# EAGLE design ctrl (EAGLE 9.4.2)
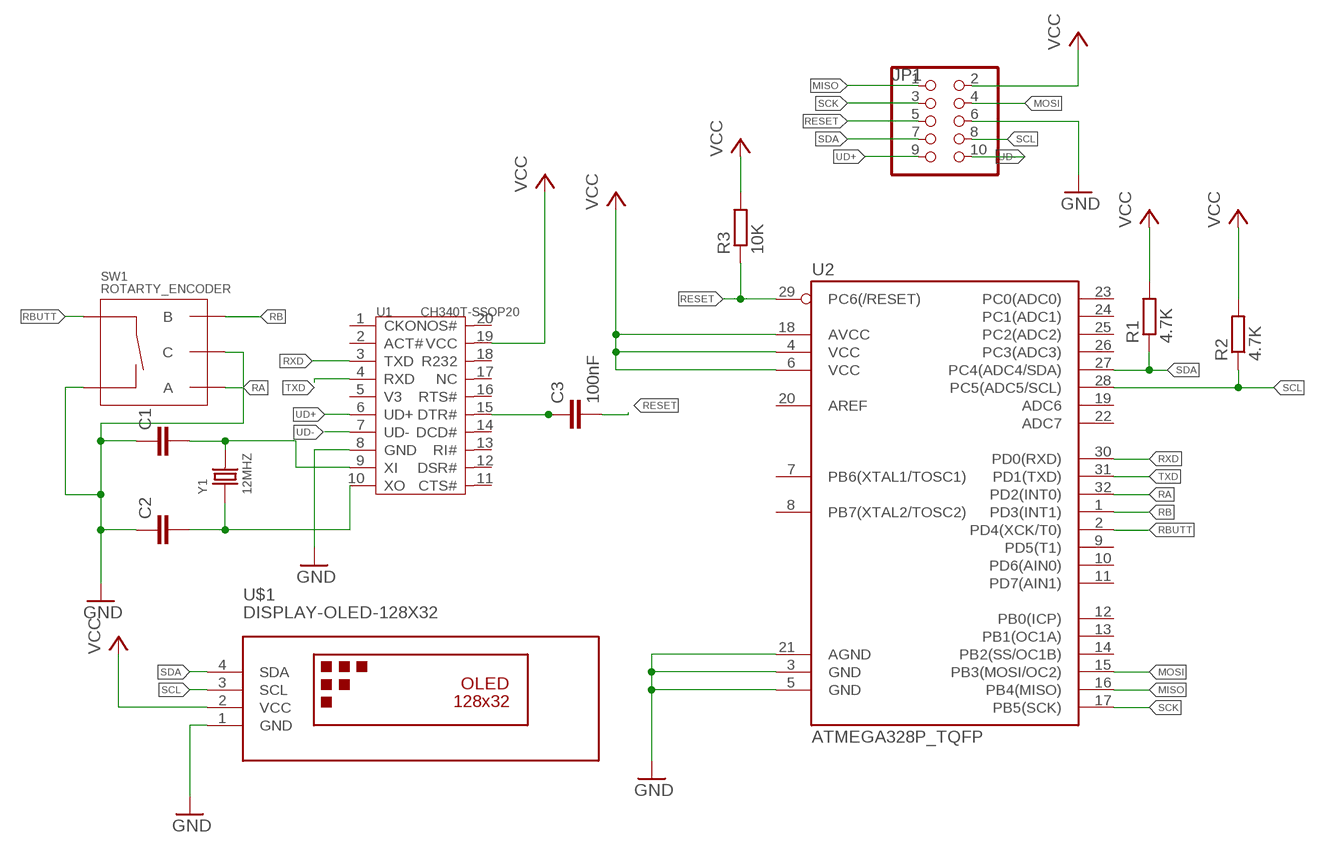
[diagram p0: schematic, sheet 1]

## Parts
C1  C-EUC0805  [C0805]
C2  C-EUC0805  [C0805]
C3  100nF  C-EUC0805  [C0805]
JP1  PINHD-2X5  [2X05]
R1  4.7K  R-EU_M0805  [M0805]
R2  4.7K  R-EU_M0805  [M0805]
R3  10K  R-EU_M0805  [M0805]
SW1  ROTARTY_ENCODER  [ROTARY_ENC_PLAIN]
U1  CH340T-SSOP20  INTERFACE-CH340T(SSOP20)  [SSOP20-0.65-7.6X5.2MM]
U2  ATMEGA328P_TQFP  [TQFP32-08]
U$1  DISPLAY-OLED-128X32  [DISPLAY-OLED-128X32]
Y1  12MHZ  SMD-CRYSTAL-12MHZ-20PF-20PPM-40R(2P-5.0X3.2MM)  [X2-SMD-5.0X3.2X1.3MM]

## Nets
GND: C1.1 C2.1 JP1.6 SW1.C SW1.SW- U1.8(GND) U2.3(GND) U2.5(GND) U2.21(AGND) U$1.1(GND)
MISO: JP1.1 U2.16(PB4(MISO))
MOSI: JP1.4 U2.15(PB3(MOSI/OC2))
N$1: C1.2 U1.9(XI) Y1.2
N$2: C3.1 U1.15(DTR#)
N$3: C2.2 U1.10(XO) Y1.1
RA: SW1.A U2.32(PD2(INT0))
RB: SW1.B U2.1(PD3(INT1))
RBUTT: SW1.SW+ U2.2(PD4(XCK/T0))
RESET: C3.2 JP1.5 R3.1 U2.29(PC6(/RESET))
RXD: U1.3(TXD) U2.30(PD0(RXD))
SCK: JP1.3 U2.17(PB5(SCK))
SCL: JP1.8 R2.1 U2.28(PC5(ADC5/SCL)) U$1.3(SCL)
SDA: JP1.7 R1.1 U2.27(PC4(ADC4/SDA)) U$1.4(SDA)
TXD: U1.4(RXD) U2.31(PD1(TXD))
UD+: JP1.9 U1.6(UD+)
UD-: JP1.10 U1.7(UD-)
VCC: JP1.2 R1.2 R2.2 R3.2 U1.19(VCC) U2.4(VCC) U2.6(VCC) U2.18(AVCC) U$1.2(VCC)
Unconnected: U1.1(CKO) U1.2(ACT#) U1.5(V3) U1.11(CTS#) U1.12(DSR#) U1.13(RI#) U1.14(DCD#) U1.16(RTS#) U1.17(NC) U1.18(R232) U1.20(NOS#) U2.7(PB6(XTAL1/TOSC1)) U2.8(PB7(XTAL2/TOSC2)) U2.9(PD5(T1)) U2.10(PD6(AIN0)) U2.11(PD7(AIN1)) U2.12(PB0(ICP)) U2.13(PB1(OC1A)) U2.14(PB2(SS/OC1B)) U2.19(ADC6) U2.20(AREF) U2.22(ADC7) U2.23(PC0(ADC0)) U2.24(PC1(ADC1)) U2.25(PC2(ADC2)) U2.26(PC3(ADC3))

## Library data of the parts
C1-C3 = resistor:C-EU: CAPACITOR, European symbol
JP1 = pinhead:PINHD-2X5: PIN HEADER
R1-R3 = resistor:R-EU_: RESISTOR, European symbol
SW1 = SparkFun-Electromechanical:ROTARTY_ENCODER: Simple no LED rotary encoder Example: COM-09117
U1 = Seeed-IC:INTERFACE-CH340T(SSOP20): 310070026; MPN: CH340T
U2 = SparkFun-DigitalIC:ATMEGA328P_TQFP; PROD_ID: IC-09069
U$1 = diy-modules:DISPLAY-OLED-128X32: 128x32 Dot Matrix OLED Module with I2C interface based on SSD1306 chip More details available here: http://www.tinyosshop.com/index.php?route=product/product&product_id=953 Schematic available here: http://www.tinyosshop.com/datasheet/OLED%2012832.pdf SSD1306 datasheet: https://cdn-shop.adafruit.com/datasheets/SSD1306.pdf Click here to find device on ebay.com <http://www.ebay.com/sch/oled+display+128x32+i2c>
Y1 = Seeed-Crystal Oscillator:SMD-CRYSTAL-12MHZ-20PF-20PPM-40R(2P-5.0X3.2MM): 306010047; MPN: 5032/2P

## Board
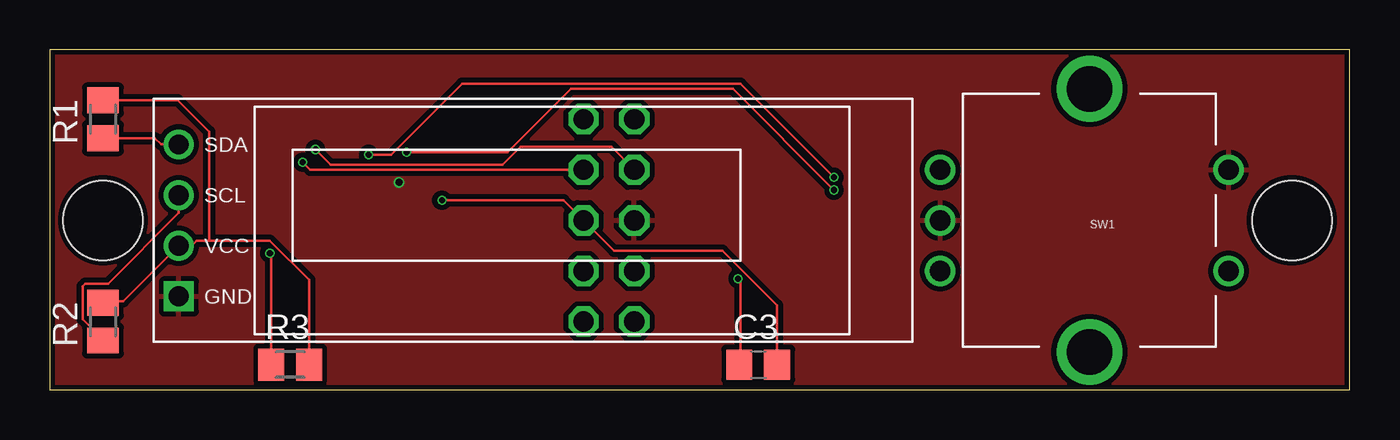
[diagram p1: board, top side]
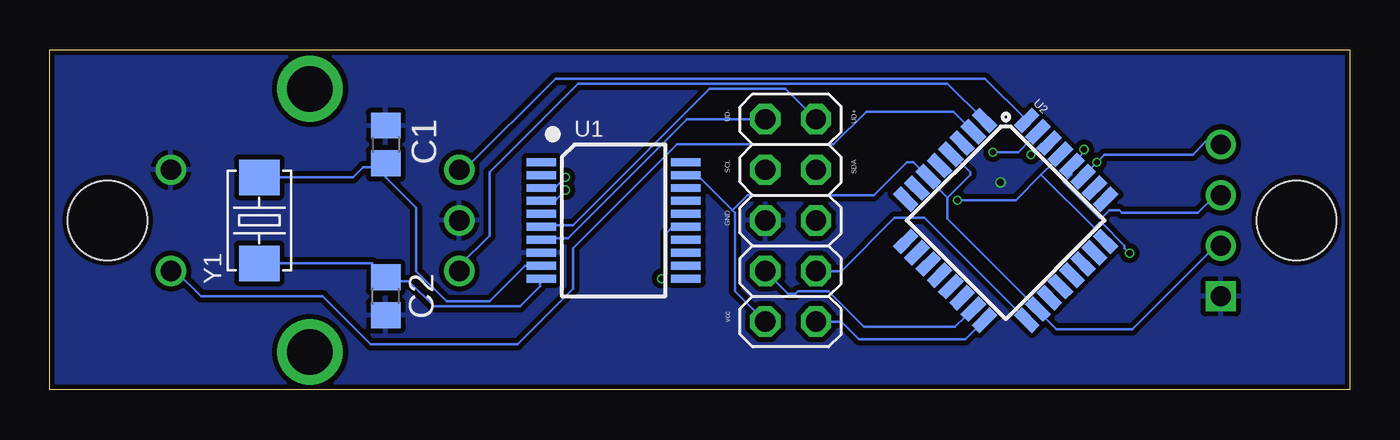
[diagram p2: board, bottom side, seen from below]

Size 65.26 x 17.07 mm. Coordinates in mm from the lower left corner, seen from the top.
Outline: 0,0 65.26,0 65.26,17.07 0,17.07 0,0
Copper layers (1*16): Top 0.035559375mm / dielectric 1.6mm / Bottom 0.035559375mm
Design rules "jlcpcb2layer": minimum track width 5mil, minimum drill 12mil, track to track 5mil, track to pad 5mil, pad to pad 5mil, via to via 5mil, smd to smd 5mil, copper to edge 8mil, drill to drill 6mil, minimum pad ring 5mil, minimum via ring 3mil, stop-mask expansion 2.5mil, vias tented up to drill 0mil, thermal gap 10mil
Holes 4 mm at 2.67,8.51 62.36,8.51

### Footprints (pad centres in the part's own frame; a part is rotated, then mirrored left to right if it is on the bottom)
C0805 = smd 1.3 x 1.5: 1 -0.95,0; 2 0.95,0
2X05 = drill 1.016 octagon: 1 -5.08,-1.27; 2 -5.08,1.27; 3 -2.54,-1.27; 4 -2.54,1.27; 5 0,-1.27; 6 0,1.27; 7 2.54,-1.27; 8 2.54,1.27; 9 5.08,-1.27; 10 5.08,1.27
M0805 = smd 1.3 x 1.6: 1 -0.95,0; 2 0.95,0
ROTARY_ENC_PLAIN = drill 1.016: A 7.493,-2.54; B 7.493,2.54; C 7.493,0; SW+ -6.985,2.54; SW- -6.985,-2.54 | drill 2.286: P$3 0,6.604; P$4 0,-6.604
SSOP20-0.65-7.6X5.2MM = smd 0.4 x 1.5: 1 -2.925,-3.625; 2 -2.275,-3.625; 3 -1.625,-3.625; 4 -0.975,-3.625; 5 -0.325,-3.625; 6 0.325,-3.625; 7 0.975,-3.625; 8 1.625,-3.625; 9 2.275,-3.625; 10 2.925,-3.625; 11 2.925,3.625; 12 2.275,3.625; 13 1.625,3.625; 14 0.975,3.625; 15 0.325,3.625; 16 -0.325,3.625; 17 -0.975,3.625; 18 -1.625,3.625; 19 -2.275,3.625; 20 -2.925,3.625
TQFP32-08 = smd 1.27 x 0.559: 1 -4.293,2.8; 2 -4.293,2; 3 -4.293,1.2; 4 -4.293,0.4; 5 -4.293,-0.4; 6 -4.293,-1.2; 7 -4.293,-2; 8 -4.293,-2.8; 17 4.293,-2.8; 18 4.293,-2; 19 4.293,-1.2; 20 4.293,-0.4; 21 4.293,0.4; 22 4.293,1.2; 23 4.293,2; 24 4.293,2.8 | smd 0.559 x 1.27: 9 -2.8,-4.293; 10 -2,-4.293; 11 -1.2,-4.293; 12 -0.4,-4.293; 13 0.4,-4.293; 14 1.2,-4.293; 15 2,-4.293; 16 2.8,-4.293; 25 2.8,4.293; 26 2,4.293; 27 1.2,4.293; 28 0.4,4.293; 29 -0.4,4.293; 30 -1.2,4.293; 31 -2,4.293; 32 -2.8,4.293
DISPLAY-OLED-128X32 = drill 1 square: 1 -17.78,-3.81 | drill 1: 2 -17.78,-1.27; 3 -17.78,1.27; 4 -17.78,3.81
X2-SMD-5.0X3.2X1.3MM = smd 1.778 x 2.032: 1 -2.159,0; 2 2.159,0

### Placement (x,y rotation side)
C1  48.39,12.32 270 bottom
C2  48.39,4.7 90 bottom
C3  35.56,1.27 0 top
JP1  28.07,8.51 90 bottom
R1  2.67,13.59 90 top
R2  2.67,3.43 90 top
R3  12.06,1.27 0 top
SW1  52.2,8.51 180 top
U1  36.96,8.51 270 bottom
U2  17.27,8.51 315 bottom
U$1  24.26,8.51 0 top
Y1  54.74,8.51 90 bottom

### Tracks (layer width: path | path; a pad name or v marks a point on that pad's centre or on a via)
GND  (via drill 0.35)
  other vias: 17.53,10.41
  pour Top (isolate 0.254): -1.14,18.67 67.44,18.67 67.44,-5.46 -1.14,-5.46
  pour Bottom (isolate 0.254): -1.14,19.94 67.44,19.94 67.44,-2.92 -1.14,-2.92
MISO
  Bottom 0.127: JP1.1 25.53,3.43 24.64,2.54 19.3,2.54 18.41,3.43 U2.16
MOSI
  Bottom 0.127: JP1.4 28.19,4.83 27.81,4.83 27.69,4.95 26.16,4.95 24.38,3.17 19.81,3.17 19.3,3.68 19.18,3.68 18.92,3.94 U2.15
N$1
  Bottom 0.127: 48.39,11.18 48.39,11.3 C1.2 48.39,11.18 | 48.39,11.18 48.39,10.67 46.86,9.14 46.86,5.97 45.34,4.44 43.18,4.44 41.4,6.22 40.64,6.22 U1.9 | Y1.2 50.04,10.67 49.53,11.18 48.39,11.18
N$2  (via drill 0.3)
  Top 0.127: v34.54,5.59 34.67,5.46 34.67,1.27 C3.1
  Bottom 0.127: v34.54,5.59 34.29,5.84 34.29,7.87 34.04,8.13 33.4,8.13 U1.15
N$3
  Bottom 0.127: U1.10 40.64,5.46 40.64,5.21 41.66,4.19 45.97,4.19 47.24,5.46 48.26,5.46 48.39,5.59 C2.2 49.09,6.35 Y1.1
RA
  Bottom 0.127: SW1.A 44.45,11.05 39.88,15.62 18.31,15.62 U2.32
RB
  Bottom 0.127: SW1.B 44.7,6.22 43.18,7.75 43.18,10.92 38.73,15.37 20.19,15.37 18.35,13.52 U2.1
RBUTT
  Bottom 0.127: SW1.SW+ 58.93,5.97 57.66,4.7 51.56,4.7 49.15,2.29 41.78,2.29 38.99,5.08 38.99,7.11 33.78,12.32 25.91,12.32 24.26,13.97 19.91,13.97 U2.2
RESET  (via drill 0.3)
  Top 0.127: v19.68,9.53 25.78,9.53 JP1.5 28.32,6.98 33.78,6.98 36.51,4.26 C3.2 | v11.05,6.86 11.12,6.79 R3.1
  Bottom 0.127: 15.49,10.79 16.76,9.53 v19.68,9.53 | 15.49,10.79 14.86,11.43 14.86,11.56 14.6,11.81 U2.29 | v11.05,6.86 11.3,7.11 11.3,7.24 12.45,8.38 12.57,8.38 12.83,8.13 15.49,10.79
RXD  (via drill 0.3)
  Top 0.127: v16,11.81 17.14,11.81 20.7,15.37 34.67,15.37 v39.37,10.67
  Bottom 0.127: v16,11.81 15.49,12.32 15.11,12.32 U2.30 | v39.37,10.67 39.88,10.16 40.51,10.16 U1.3
SCK
  Bottom 0.127: JP1.3 25.53,5.97 22.86,8.64 21.36,8.64 U2.17
SCL  (via drill 0.3)
  Top 0.127: R2.1 2.67,2.54 1.65,3.56 1.65,5.21 1.78,5.33 2.92,5.33 6.48,8.89 U$1.3 | v13.33,12.06 14.1,11.3 22.73,11.3 23.62,12.19 28.19,12.19 JP1.8
  Bottom 0.127: U$1.3 6.73,9.78 7.62,8.89 11.43,8.89 11.56,9.02 12.06,9.02 12.45,8.64 12.57,8.64 14.35,10.41 13.97,10.79 13.97,11.18 U2.28 13.97,11.3 13.33,11.94 v13.33,12.06
SDA  (via drill 0.3)
  Top 0.127: JP1.7 13.08,11.05 v12.7,11.43 | U$1.4 5.59,12.32 5.27,12.64 R1.1
  Bottom 0.127: U$1.4 6.6,12.45 7.24,12.45 7.87,11.81 12.32,11.81 v12.7,11.43 13.33,10.79 U2.27
TXD  (via drill 0.3)
  Top 0.127: v17.91,11.94 22.99,11.94 26.16,15.11 34.29,15.11 v39.37,10.03
  Bottom 0.127: v17.91,11.94 16.64,11.94 16,12.57 16,12.7 15.75,12.95 U2.31 | v39.37,10.03 39.88,9.53 40.51,9.53 U1.4
UD+
  Bottom 0.127: JP1.9 28.32,15.11 32.13,15.11 38.99,8.25 40.51,8.25 U1.6
UD-
  Bottom 0.127: JP1.10 33.27,13.59 39.24,7.62 40.5,7.62 U1.7
VCC
  Top 0.127: 8,7.49 7.37,7.49 7.11,7.24 U$1.2 3.68,4.44 2.73,4.44 R2.2 | 8,7.49 11.05,7.49 13.01,5.53 R3.2 | 8,7.49 8,12.95 6.42,14.54 R1.2
  Bottom 0.127: 30.99,9.02 30.86,8.89 30.86,4.95 JP1.2 | 30.99,9.02 32.64,10.67 33.27,10.67 U1.19 | 20.19,9.65 21.21,10.67 U2.6 21.89,11.43 22.23,11.43 23.88,9.78 30.23,9.78 30.99,9.02 | 20.19,9.65 19.05,10.79 19.05,10.92 19.94,11.81 U2.4 | U$1.2 6.73,7.24 10.92,3.05 14.73,3.05 15.62,3.94 U2.18 20.19,8.6 20.19,9.65

### Text on the board
bPlace: UD+ | UD- | SDA | SCL | GND | vcc